# EAGLE design Model 64 Sequencer Cartridge v1 (EAGLE 9.6.2)
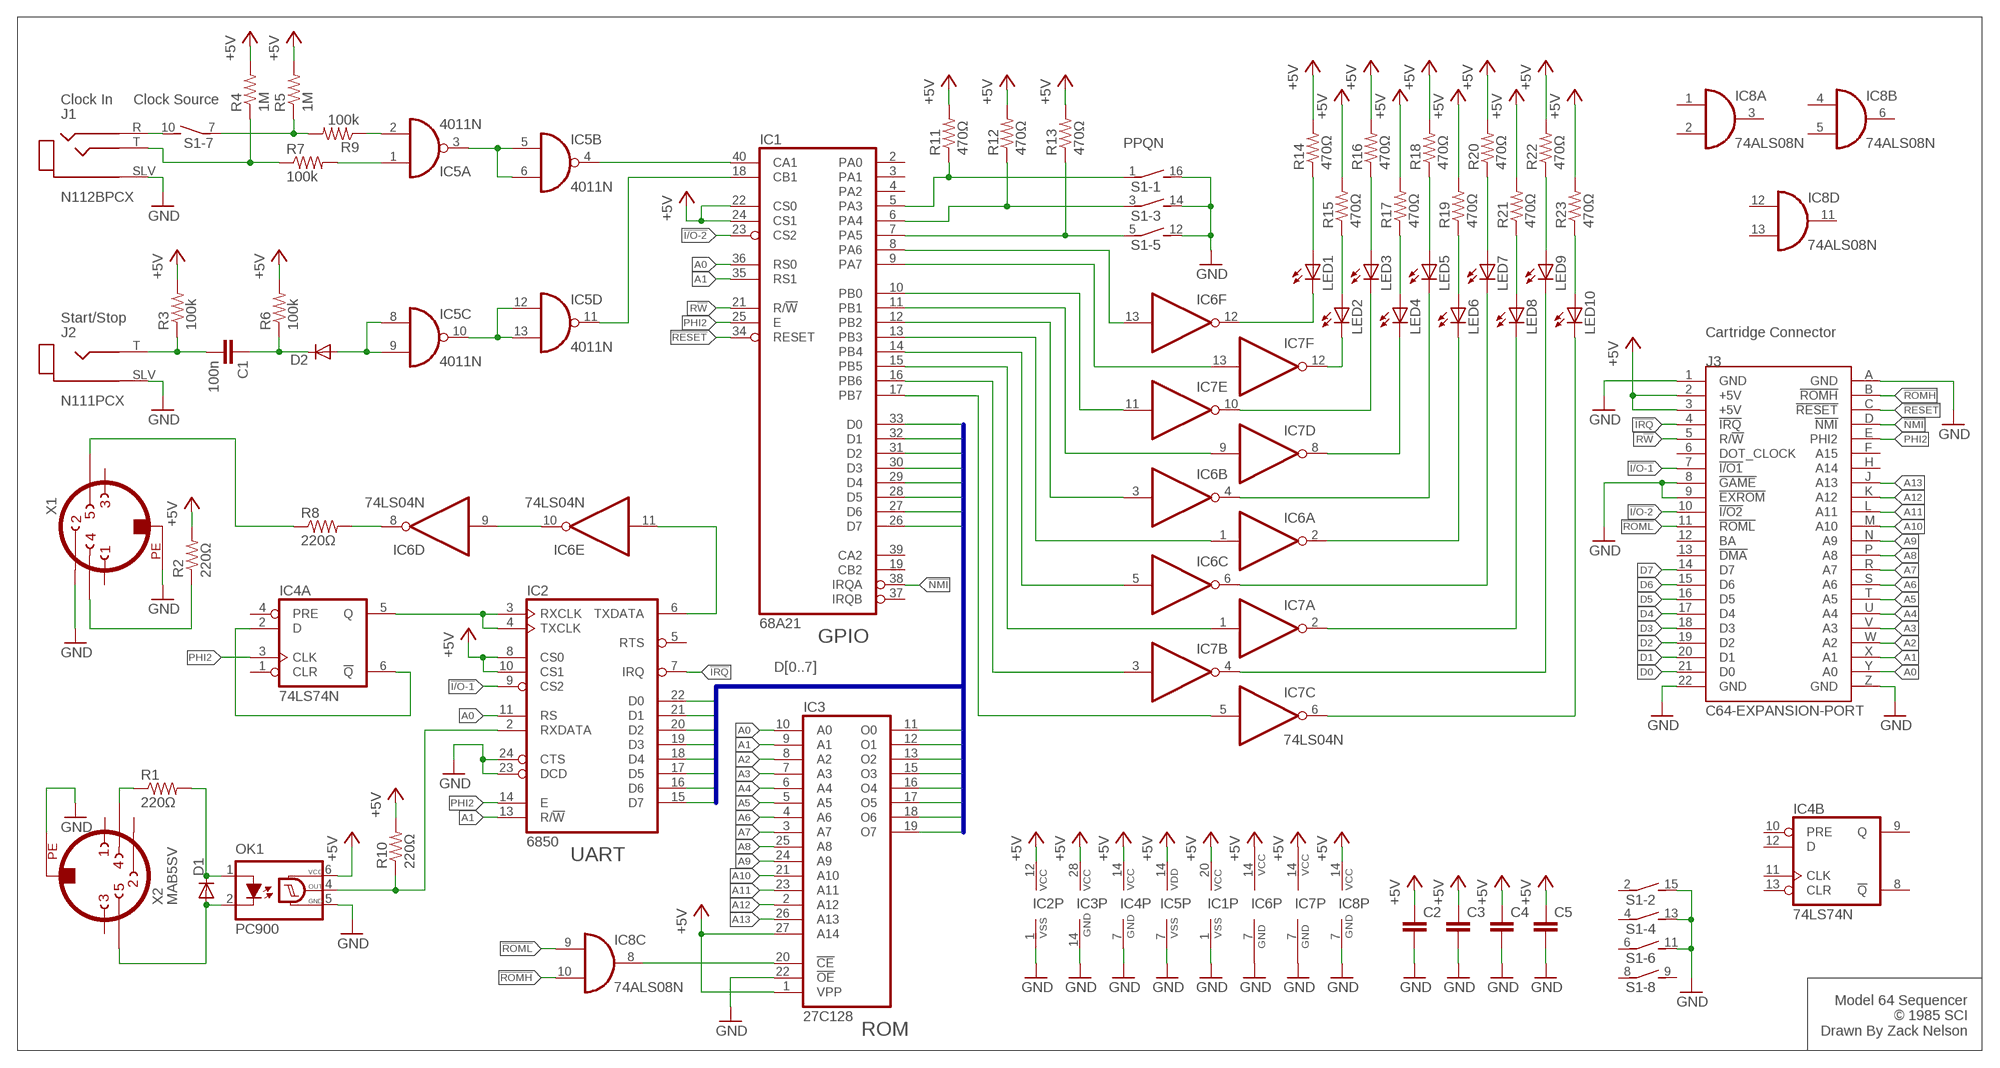
[diagram p0: schematic, sheet 1]

## Parts
C1  100n  C-EU050-024X044  [C050-024X044]
C2  C-EU050-024X044  [C050-024X044]
C3  C-EU050-024X044  [C050-024X044]
C4  C-EU050-024X044  [C050-024X044]
C5  C-EU050-024X044  [C050-024X044]
D1  DIODE-D-7.5  [D-7.5]
D2  DIODE-D-7.5  [D-7.5]
IC1  68A21  6821  [DIL40]
IC2  6850  [DIL24]
IC3  27C128  27256  [DIL28]
IC4  74LS74N  [DIL14]
IC5  4011N  [DIL14]
IC6  74LS04N  [DIL14]
IC7  74LS04N  [DIL14]
IC8  74ALS08N  [DIL14]
J1  N112BPCX  [SWITCHCRAFT_N112BPCX]
J2  N111PCX  [SWITCHCRAFT_N111PCX]
J3  C64-EXPANSION-PORT  C64-EXPANSIONPNARROW  [EXPANSIO_SQ]
LED1  LED3MM  [LED3MM]
LED2  LED3MM  [LED3MM]
LED3  LED3MM  [LED3MM]
LED4  LED3MM  [LED3MM]
LED5  LED3MM  [LED3MM]
LED6  LED3MM  [LED3MM]
LED7  LED3MM  [LED3MM]
LED8  LED3MM  [LED3MM]
LED9  LED3MM  [LED3MM]
LED10  LED3MM  [LED3MM]
OK1  PC900  H11L1M  [DIL06]
R1  220Ω  R-US_0207/12  [0207/12]
R2  220Ω  R-US_0207/12  [0207/12]
R3  100k  R-US_0207/12  [0207/12]
R4  1M  R-US_0207/12  [0207/12]
R5  1M  R-US_0207/12  [0207/12]
R6  100k  R-US_0207/12  [0207/12]
R7  100k  R-US_0207/12  [0207/12]
R8  220Ω  R-US_0207/12  [0207/12]
R9  100k  R-US_0207/12  [0207/12]
R10  220Ω  R-US_0207/12  [0207/12]
R11  470Ω  R-US_0207/12  [0207/12]
R12  470Ω  R-US_0207/12  [0207/12]
R13  470Ω  R-US_0207/12  [0207/12]
R14  470Ω  R-US_0207/12  [0207/12]
R15  470Ω  R-US_0207/12  [0207/12]
R16  470Ω  R-US_0207/12  [0207/12]
R17  470Ω  R-US_0207/12  [0207/12]
R18  470Ω  R-US_0207/12  [0207/12]
R19  470Ω  R-US_0207/12  [0207/12]
R20  470Ω  R-US_0207/12  [0207/12]
R21  470Ω  R-US_0207/12  [0207/12]
R22  470Ω  R-US_0207/12  [0207/12]
R23  470Ω  R-US_0207/12  [0207/12]
S1  DIP08S  [DIP08S]
X1  MAB5SV  [MAB5SV]
X2  MAB5SV  [MAB5SV]

## Nets
!I/O-1: IC2.9(CS2) J3.7(!I/O1)
!I/O-2: IC1.23(CS2) J3.10(!I/O2)
!IRQ: IC2.7(IRQ) J3.4(!IRQ)
!NMI: IC1.38(IRQA) J3.D(!NMI)
!RESET: IC1.34(RESET) J3.C(!RESET)
!ROMH: IC8.10(C:I1) J3.B(!ROMH)
!ROML: IC8.9(C:I0) J3.11(!ROML)
+5V: C2.1 C3.1 C4.1 C5.1 IC1.20(VCC) IC1.22(CS0) IC1.24(CS1) IC2.8(CS0) IC2.10(CS1) IC2.12(VCC) IC3.1(VPP) IC3.27(A14) IC3.28(VCC) IC4.14(P:VCC) IC5.14(P:VDD) IC6.14(P:VCC) IC7.14(P:VCC) IC8.14(P:VCC) J3.2(+5V) J3.3(+5V) OK1.6(VCC) R2.2 R3.2 R4.2 R5.2 R6.2 R10.2 R11.2 R12.2 R13.2 R14.2 R15.2 R16.2 R17.2 R18.2 R19.2 R20.2 R21.2 R22.2 R23.2
A0: IC1.36(RS0) IC2.11(RS) IC3.10(A0) J3.Y(A0)
A1: IC1.35(RS1) IC2.13(R/!W) IC3.9(A1) J3.X(A1)
A2: IC3.8(A2) J3.W(A2)
A3: IC3.7(A3) J3.V(A3)
A4: IC3.6(A4) J3.U(A4)
A5: IC3.5(A5) J3.T(A5)
A6: IC3.4(A6) J3.S(A6)
A7: IC3.3(A7) J3.R(A7)
A8: IC3.25(A8) J3.P(A8)
A9: IC3.24(A9) J3.N(A9)
A10: IC3.21(A10) J3.M(A10)
A11: IC3.23(A11) J3.L(A11)
A12: IC3.2(A12) J3.K(A12)
A13: IC3.26(A13) J3.J(A13)
D0: IC1.33(D0) IC2.22(D0) IC3.11(O0) J3.21(D0)
D1: IC1.32(D1) IC2.21(D1) IC3.12(O1) J3.20(D1)
D2: IC1.31(D2) IC2.20(D2) IC3.13(O2) J3.19(D2)
D3: IC1.30(D3) IC2.19(D3) IC3.15(O3) J3.18(D3)
D4: IC1.29(D4) IC2.18(D4) IC3.16(O4) J3.17(D4)
D5: IC1.28(D5) IC2.17(D5) IC3.17(O5) J3.16(D5)
D6: IC1.27(D6) IC2.16(D6) IC3.18(O6) J3.15(D6)
D7: IC1.26(D7) IC2.15(D7) IC3.19(O7) J3.14(D7)
GND: C2.2 C3.2 C4.2 C5.2 IC1.1(VSS) IC2.1(VSS) IC2.23(DCD) IC2.24(CTS) IC3.14(GND) IC3.22(!OE) IC4.7(P:GND) IC5.7(P:VSS) IC6.7(P:GND) IC7.7(P:GND) IC8.7(P:GND) J1.SLV(SLEEVE) J2.SLV(SLEEVE) J3.1(GND) J3.8(!GAME) J3.9(!EXROM) J3.22(GND) J3.A(GND) J3.Z(GND) OK1.5(GND) S1.11 S1.12 S1.13 S1.14 S1.15 S1.16 X1.2 X1.PE X2.PE
N$1: IC2.3(RXCLK) IC2.4(TXCLK) IC4.5(A:Q)
N$2: R2.1 X1.4
N$3: IC2.6(TXDATA) IC6.11(E:I)
N$4: IC4.2(A:D) IC4.6(A:!Q)
N$5: IC6.9(D:I) IC6.10(E:O)
N$6: IC6.8(D:O) R8.2
N$7: IC1.13(PB3) IC6.1(A:I)
N$8: IC5.3(A:O) IC5.5(B:I0) IC5.6(B:I1)
N$9: D2.A IC5.8(C:I0) IC5.9(C:I1)
N$10: IC5.10(C:O) IC5.12(D:I0) IC5.13(D:I1)
N$11: IC1.18(CB1) IC5.11(D:O)
N$12: IC1.40(CA1) IC5.4(B:O)
N$13: IC5.1(A:I0) R7.2
N$14: LED6.A R19.1
N$15: LED5.A R18.1
N$16: LED7.A R20.1
N$17: LED1.A R14.1
N$18: LED2.A R15.1
N$19: LED8.A R21.1
N$20: LED9.A R22.1
N$21: IC7.2(A:O) LED8.K(C)
N$22: IC7.4(B:O) LED9.K(C)
N$23: IC7.6(C:O) LED10.K(C)
N$24: IC7.8(D:O) LED4.K(C)
N$25: IC7.10(E:O) LED3.K(C)
N$26: IC7.12(F:O) LED2.K(C)
N$27: LED10.A R23.1
N$28: LED4.A R17.1
N$29: LED3.A R16.1
N$30: IC1.5(PA3) R11.1 S1.1
N$31: IC1.6(PA4) R12.1 S1.3
N$32: IC1.7(PA5) R13.1 S1.5
N$33: J1.T(TIP) R4.1 R7.1
N$34: C1.1 D2.C R6.1
N$35: C1.2 J2.T(TIP) R3.1
N$36: IC5.2(A:I1) R9.1
N$37: R5.1 R9.2 S1.7
N$38: J1.R(RING) S1.10
N$39: D1.A OK1.2(C) X2.5
N$40: D1.C OK1.1(A) R1.2
N$41: IC2.2(RXDATA) OK1.4(OUT) R10.1
N$42: IC6.12(F:O) LED1.K(C)
N$43: IC1.15(PB5) IC7.1(A:I)
N$44: IC1.9(PA7) IC7.13(F:I)
N$45: IC1.16(PB6) IC7.3(B:I)
N$46: IC1.17(PB7) IC7.5(C:I)
N$47: IC1.11(PB1) IC7.9(D:I)
N$48: IC1.10(PB0) IC7.11(E:I)
N$49: IC1.8(PA6) IC6.13(F:I)
N$50: IC6.6(C:O) LED7.K(C)
N$51: IC1.14(PB4) IC6.5(C:I)
N$52: IC1.12(PB2) IC6.3(B:I)
N$53: IC6.4(B:O) LED5.K(C)
N$54: IC6.2(A:O) LED6.K(C)
N$55: R8.1 X1.5
N$56: R1.1 X2.4
N$57: IC3.20(!CE) IC8.8(C:O)
PHI2: IC1.25(E) IC2.14(E) IC4.3(A:CLK) J3.E(PHI2)
R!W: IC1.21(R/!W) J3.5(R/!W)
Unconnected: IC1.2(PA0) IC1.3(PA1) IC1.4(PA2) IC1.19(CB2) IC1.37(IRQB) IC1.39(CA2) IC2.5(RTS) IC4.1(A:CLR) IC4.4(A:PRE) IC4.8(B:!Q) IC4.9(B:Q) IC4.10(B:PRE) IC4.11(B:CLK) IC4.12(B:D) IC4.13(B:CLR) IC8.1(A:I0) IC8.2(A:I1) IC8.3(A:O) IC8.4(B:I0) IC8.5(B:I1) IC8.6(B:O) IC8.11(D:O) IC8.12(D:I0) IC8.13(D:I1) J3.6(DOT_CLOCK) J3.12(BA) J3.13(!DMA) J3.F(A15) J3.H(A14) S1.2 S1.4 S1.6 S1.8 S1.9 X1.1 X1.3 X2.1 X2.2 X2.3

## Buses
D[0..7]

## Notes on the sheet
- Clock In | Clock Source
- PPQN
- Start/Stop
- Cartridge Connector
- GPIO
- UART
- ROM
- Model 64 Sequencer
  © 1985 SCI
  Drawn By Zack Nelson

## Library data of the parts
C1-C5 = rcl:C-EU: CAPACITOR, European symbol; SPICEPREFIX: C
D1 D2 = diode:DIODE-: DIODE
IC1 = micro-motorola:6821: MICROCONTROLLER/MEMORY DEVICE; MF: NTE ELECTRONICS; MPN: NTE6821; OC_FARNELL: 1652403; OC_NEWARK: 29C4772
IC2 = micro-motorola:6850: MICROCONTROLLER/MEMORY DEVICE; MF: NTE ELECTRONICS; MPN: NTE6850; OC_FARNELL: 4899775; OC_NEWARK: 31C2457
IC3 = memory:27256: MEMORY
IC4 = 74xx-eu:74*74: Dual D type positive edge triggered FLIP FLOP, preset and clear
IC5 = 40xx:4011: Quad 2-input NAND
IC6 IC7 = 74xx-us:74*04: Hex INVERTER
IC8 = 74xx-eu:74*08: Quad 2-input AND gate
J1 = N112BPCX:N112BPCX; MANUFACTURER: Switchcarft; MAXIMUM_PACKAGE_HIEGHT: 28.12mm; PARTREV: A; STANDARD: IPC 7351B
J2 = N111PCX:N111PCX; MANUFACTURER: Switchcarft; MAXIMUM_PACKAGE_HIEGHT: 28.12mm; PARTREV: A; STANDARD: IPC 7351B
J3 = Commodore:C64-EXPANSIONP
LED1-LED10 = led:LED: LED OSRAM: - CHIPLED LG R971, LG N971, LY N971, LG Q971, LY Q971, LO R971, LY R971 LH N974, LH R974 LS Q976, LO Q976, LY Q976 LO Q996 - Hyper CHIPLED LW Q18S LB Q993, LB Q99A, LB R99A - SideLED LS A670, LO A670, LY A670, LG A670, LP A670 LB A673, LV A673, LT A673, LW A673 LH A674 LY A675 LS A676, LA A676, LO A676, LY A676, LW A676 LS A679, LY A679, LG A679 - Hyper Micro SIDELED® LS Y876, LA Y876, LO Y876, LY Y876 LT Y87S - SmartLED LW L88C, LW L88S LB L89C, LB L89S, LG L890 LS L89K, LO L89K, LY L89K LS L896, LA L896, LO L896, LY L896 - TOPLED LS T670, LO T670, LY T670, LG T670, LP T670 LSG T670, LSP T670, LSY T670, LOP T670, LYG T670 LG T671, LOG T671, LSG T671 LB T673, LV T673, LT T673, LW T673 LH T674 LS T676, LA T676, LO T676, LY T676, LB T676, LH T676, LSB T676, LW T676 LB T67C, LV T67C, LT T67C, LS T67K, LO T67K, LY T67K, LW E67C LS E67B, LA E67B, LO E67B, LY E67B, LB E67C, LV E67C, LT E67C LW T67C LS T679, LY T679, LG T679 LS T770, LO T770, LY T770, LG T770, LP T770 LB T773, LV T773, LT T773, LW T773 LH T774 LS E675, LA E675, LY E675, LS T675 LS T776, LA T776, LO T776, LY T776, LB T776 LHGB T686 LT T68C, LB T68C - Hyper Mini TOPLED® LB M676 - Mini TOPLED Santana® LG M470 LS M47K, LO M47K, LY M47K Source: http://www.osram.convergy.de LUXEON: - LUMILED® LXK2-PW12-R00, LXK2-PW12-S00, LXK2-PW14-U00, LXK2-PW14-V00 LXK2-PM12-R00, LXK2-PM12-S00, LXK2-PM14-U00 LXK2-PE12-Q00, LXK2-PE12-R00, LXK2-PE12-S00, LXK2-PE14-T00, LXK2-PE14-U00 LXK2-PB12-K00, LXK2-PB12-L00, LXK2-PB12-M00, LXK2-PB14-N00, LXK2-PB14-P00, LXK2-PB14-Q00 LXK2-PR12-L00, LXK2-PR12-M00, LXK2-PR14-Q00, LXK2-PR14-R00 LXK2-PD12-Q00, LXK2-PD12-R00, LXK2-PD12-S00 LXK2-PH12-R00, LXK2-PH12-S00 LXK2-PL12-P00, LXK2-PL12-Q00, LXK2-PL12-R00 Source: www.luxeon.com KINGBRIGHT: KA-3528ASYC Source: www.kingbright.com
OK1 = optocoupler:H11L*M: 6-Pin DIP Optocoupler Source: http://www.fairchildsemi.com/ds/H1/H11L2-M.pdf; MF: FAIRCHILD SEMICONDUCTOR; MPN: H11L1-M; OC_FARNELL: 1021127; OC_NEWARK: 72K8643
R1-R23 = rcl:R-US_: RESISTOR, American symbol; SPICEPREFIX: R
S1 = switch-dil:DIP08S: DIL/CODE SWITCH; OC_FARNELL: unknown; OC_NEWARK: unknown
X1 X2 = con-hirschmann:MAB5SV: Female CONNECTOR 5 pins 90 deg. with shield, vertical (DIN41524); OC_FARNELL: unknown; OC_NEWARK: unknown

## Board
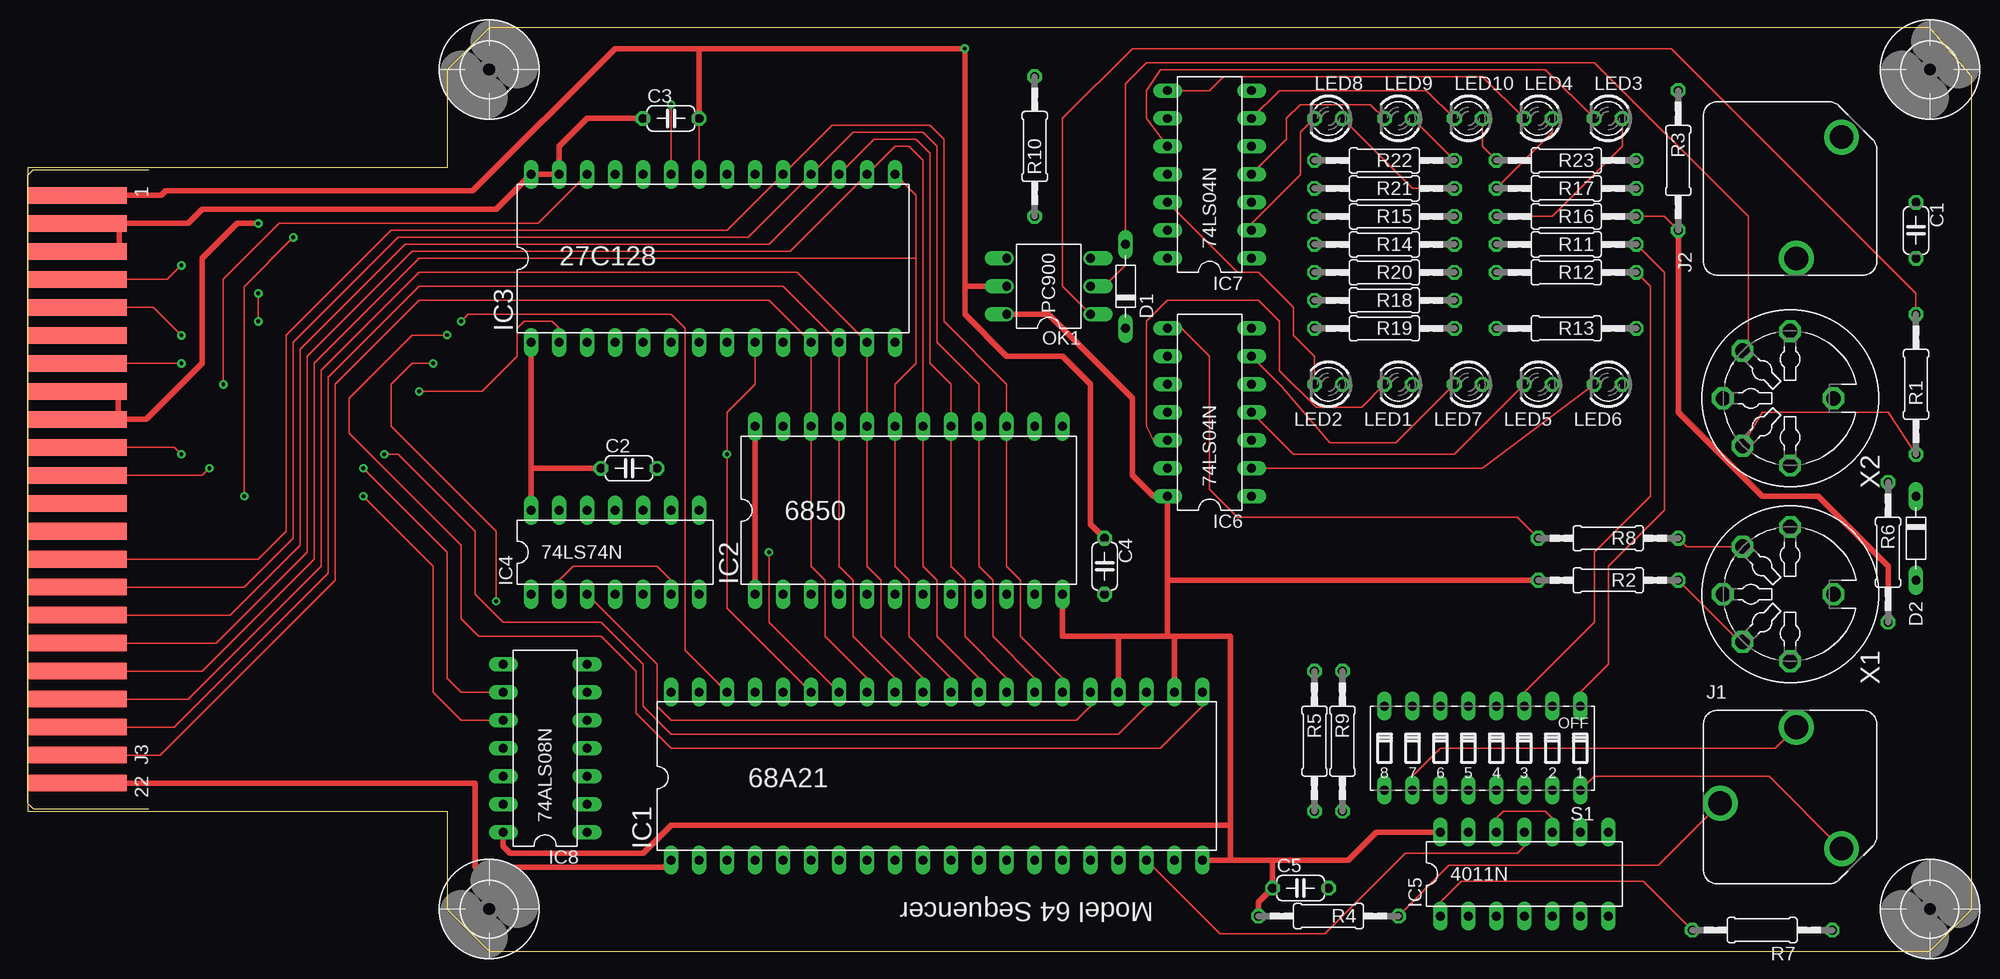
[diagram p1: board, top side]
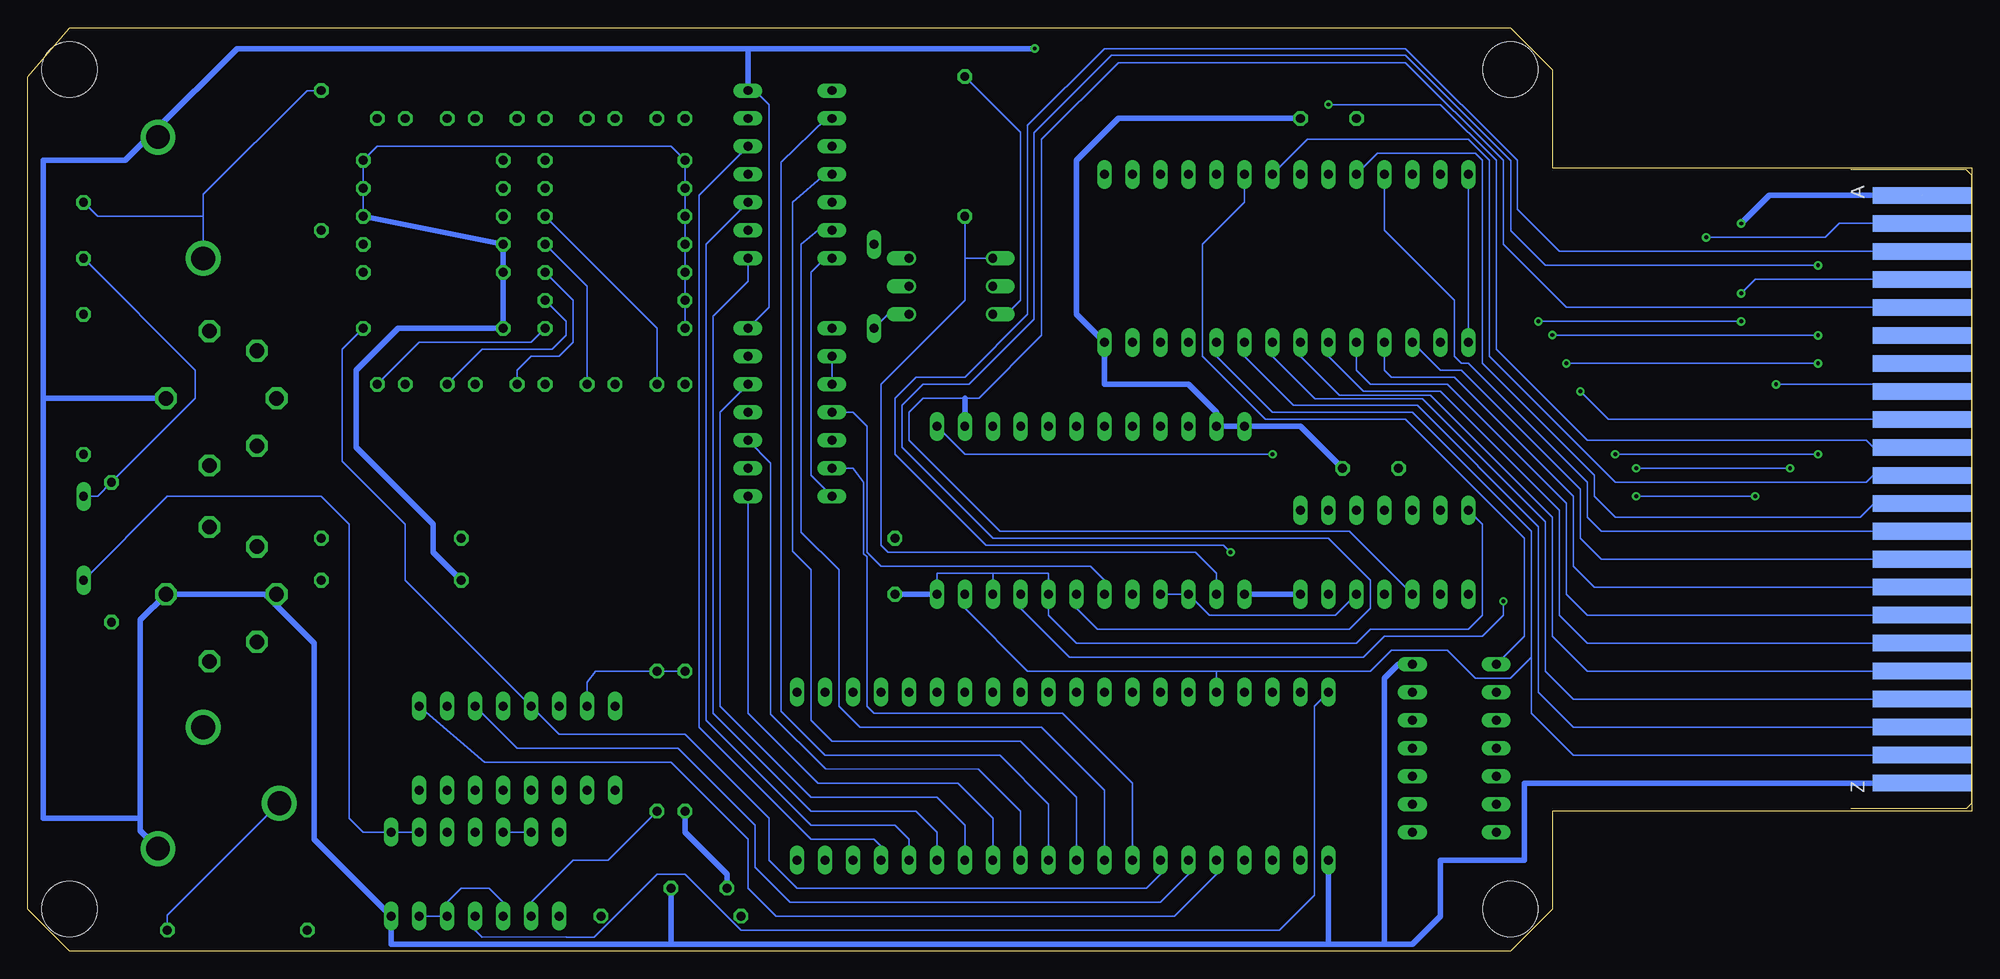
[diagram p2: board, bottom side, seen from below]

Size 176.53 x 83.82 mm. Coordinates in mm from the lower left corner, seen from the top.
Outline: 0,12.7 38.1,12.7 38.1,3.81 41.91,0 172.72,0 176.53,3.81 176.53,79.38 172.72,83.82 171.12,83.81 41.91,83.82 38.1,80.01 38.1,71.11 0,71.11 0,12.7
Copper layers (1*16): Top 0.035mm / dielectric 1.5mm / Bottom 0.035mm
Design rules "default": minimum track width 6mil, minimum drill 0.35mm, track to track 6mil, track to pad 6mil, pad to pad 6mil, via to via 6mil, smd to smd 6mil, copper to edge 40mil, drill to drill 6mil, minimum pad ring 10mil, minimum via ring 8mil, stop-mask expansion 4mil, vias tented up to drill 0mil, thermal gap 10mil

### Footprints (pad centres in the part's own frame; a part is rotated, then mirrored left to right if it is on the bottom)
C050-024X044 = drill 0.813 octagon: 1 -2.54,0; 2 2.54,0
D-7.5 = drill 0.813 long: A 3.81,0; C -3.81,0
DIL40 = drill 0.813 long: 1 -24.13,-7.62; 2 -21.59,-7.62; 3 -19.05,-7.62; 4 -16.51,-7.62; 5 -13.97,-7.62; 6 -11.43,-7.62; 7 -8.89,-7.62; 8 -6.35,-7.62; 9 -3.81,-7.62; 10 -1.27,-7.62; 11 1.27,-7.62; 12 3.81,-7.62; 13 6.35,-7.62; 14 8.89,-7.62; 15 11.43,-7.62; 16 13.97,-7.62; 17 16.51,-7.62; 18 19.05,-7.62; 19 21.59,-7.62; 20 24.13,-7.62; 21 24.13,7.62; 22 21.59,7.62; 23 19.05,7.62; 24 16.51,7.62; 25 13.97,7.62; 26 11.43,7.62; 27 8.89,7.62; 28 6.35,7.62; 29 3.81,7.62; 30 1.27,7.62; 31 -1.27,7.62; 32 -3.81,7.62; 33 -6.35,7.62; 34 -8.89,7.62; 35 -11.43,7.62; 36 -13.97,7.62; 37 -16.51,7.62; 38 -19.05,7.62; 39 -21.59,7.62; 40 -24.13,7.62
DIL24 = drill 0.813 long: 1 -13.97,-7.62; 2 -11.43,-7.62; 3 -8.89,-7.62; 4 -6.35,-7.62; 5 -3.81,-7.62; 6 -1.27,-7.62; 7 1.27,-7.62; 8 3.81,-7.62; 9 6.35,-7.62; 10 8.89,-7.62; 11 11.43,-7.62; 12 13.97,-7.62; 13 13.97,7.62; 14 11.43,7.62; 15 8.89,7.62; 16 6.35,7.62; 17 3.81,7.62; 18 1.27,7.62; 19 -1.27,7.62; 20 -3.81,7.62; 21 -6.35,7.62; 22 -8.89,7.62; 23 -11.43,7.62; 24 -13.97,7.62
DIL28 = drill 0.813 long: 1 -16.51,-7.62; 2 -13.97,-7.62; 3 -11.43,-7.62; 4 -8.89,-7.62; 5 -6.35,-7.62; 6 -3.81,-7.62; 7 -1.27,-7.62; 8 1.27,-7.62; 9 3.81,-7.62; 10 6.35,-7.62; 11 8.89,-7.62; 12 11.43,-7.62; 13 13.97,-7.62; 14 16.51,-7.62; 15 16.51,7.62; 16 13.97,7.62; 17 11.43,7.62; 18 8.89,7.62; 19 6.35,7.62; 20 3.81,7.62; 21 1.27,7.62; 22 -1.27,7.62; 23 -3.81,7.62; 24 -6.35,7.62; 25 -8.89,7.62; 26 -11.43,7.62; 27 -13.97,7.62; 28 -16.51,7.62
DIL14 = drill 0.813 long: 1 -7.62,-3.81; 2 -5.08,-3.81; 3 -2.54,-3.81; 4 0,-3.81; 5 2.54,-3.81; 6 5.08,-3.81; 7 7.62,-3.81; 8 7.62,3.81; 9 5.08,3.81; 10 2.54,3.81; 11 0,3.81; 12 -2.54,3.81; 13 -5.08,3.81; 14 -7.62,3.81
SWITCHCRAFT_N112BPCX = drill 2.159: R 0.559,6.35; SLV 4.669,-4.669; T -6.35,-0.559
SWITCHCRAFT_N111PCX = drill 2.159: SLV 4.669,-4.669; T -6.35,-0.559
EXPANSIO_SQ = smd 1.5 x 9: 1 26.67,-4.5; 2 24.13,-4.5; 3 21.59,-4.5; 4 19.05,-4.5; 5 16.51,-4.5; 6 13.97,-4.5; 7 11.43,-4.5; 8 8.89,-4.5; 9 6.35,-4.5; 10 3.81,-4.5; 11 1.27,-4.5; 12 -1.27,-4.5; 13 -3.81,-4.5; 14 -6.35,-4.5; 15 -8.89,-4.5; 16 -11.43,-4.5; 17 -13.97,-4.5; 18 -16.51,-4.5; 19 -19.05,-4.5; 20 -21.59,-4.5; 21 -24.13,-4.5; 22 -26.67,-4.5 | smd 1.5 x 9 bottom: A 26.67,-4.5; B 24.13,-4.5; C 21.59,-4.5; D 19.05,-4.5; E 16.51,-4.5; F 13.97,-4.5; H 11.43,-4.5; J 8.89,-4.5; K 6.35,-4.5; L 3.81,-4.5; M 1.27,-4.5; N -1.27,-4.5; P -3.81,-4.5; R -6.35,-4.5; S -8.89,-4.5; T -11.43,-4.5; U -13.97,-4.5; V -16.51,-4.5; W -19.05,-4.5; X -21.59,-4.5; Y -24.13,-4.5; Z -26.67,-4.5
LED3MM = drill 0.813 octagon: A -1.27,0; K 1.27,0
DIL06 = drill 0.813 offset: 1 -2.54,-3.81; 2 0,-3.81; 3 2.54,-3.81; 4 2.54,3.81; 5 0,3.81; 6 -2.54,3.81
0207/12 = drill 0.813 octagon: 1 -6.35,0; 2 6.35,0
DIP08S = drill 0.813 long: 1 -8.89,-3.81; 2 -6.35,-3.81; 3 -3.81,-3.81; 4 -1.27,-3.81; 5 1.27,-3.81; 6 3.81,-3.81; 7 6.35,-3.81; 8 8.89,-3.81; 9 8.89,3.81; 10 6.35,3.81; 11 3.81,3.81; 12 1.27,3.81; 13 -1.27,3.81; 14 -3.81,3.81; 15 -6.35,3.81; 16 -8.89,3.81
5,0 = hole 5: 0,0
MAB5SV = drill 1.321 octagon: 1 6.096,0; 2 0,-6.096; 3 -6.096,0; 4 4.318,-4.318; 5 -4.318,-4.318; PE 0,3.937

### Placement (x,y rotation side)
C1  171.45,65.41 90 top
C2  54.61,43.81 0 top
C3  58.42,75.56 0 top
C4  97.79,34.92 90 top
C5  115.57,5.71 0 top
D1  99.69,60.32 90 top
D2  171.45,37.46 270 top
IC1  82.55,15.88 0 top
IC2  80.01,40 0 top
IC3  62.23,62.86 0 top
IC4  53.34,36.2 0 top
IC5  135.89,6.99 0 top
IC6  107.31,48.89 90 top
IC7  107.31,70.48 90 top
IC8  46.99,18.41 90 top
J1  160.02,13.97 0 top
J2  160.02,69.22 90 top
J3  0,41.91 90 top
LED1  124.46,51.44 180 top
LED2  118.11,51.44 180 top
LED3  143.51,75.56 180 top
LED4  137.16,75.56 180 top
LED5  137.16,51.44 180 top
LED6  143.51,51.44 180 top
LED7  130.81,51.44 180 top
LED8  118.11,75.56 180 top
LED9  124.46,75.56 180 top
LED10  130.81,75.56 180 top
OK1  92.71,60.32 90 top
R1  171.45,51.44 90 top
R2  143.51,33.66 180 top
R3  149.86,71.75 270 top
R4  118.11,3.17 180 top
R5  116.84,19.05 270 top
R6  168.91,36.2 270 top
R7  157.48,1.91 180 top
R8  143.51,37.46 180 top
R9  119.38,19.05 90 top
R10  91.44,73.03 90 top
R11  139.7,64.14 180 top
R12  139.7,61.59 180 top
R13  139.7,56.52 180 top
R14  123.19,64.14 180 top
R15  123.19,66.67 180 top
R16  139.7,66.67 0 top
R17  139.7,69.22 0 top
R18  123.19,59.05 180 top
R19  123.19,56.52 180 top
R20  123.19,61.59 180 top
R21  123.19,69.22 180 top
R22  123.19,71.75 180 top
R23  139.7,71.75 0 top
S1  132.08,18.41 180 top
U$1  [5,0]  41.91,3.81 0 top
U$2  [5,0]  41.91,80.01 0 top
U$3  [5,0]  172.72,80.01 0 top
U$4  [5,0]  172.72,3.81 0 top
X1  160.02,32.38 270 top
X2  160.02,50.16 270 top

### Tracks (layer width: path | path; a pad name or v marks a point on that pad's centre or on a via)
!I/O-1  (via drill 0.35)
  Top 0.152: v42.55,31.75 42.55,38.1 33.02,47.62 33.02,51.44 34.92,53.34 v36.83,53.34 | v13.97,53.34 J3.7
  Bottom 0.152: IC2.9 86.36,31.12 81.92,26.67 55.24,26.67 53.34,28.57 44.45,28.57 42.55,30.48 v42.55,31.75 | v36.83,53.34 v13.97,53.34
!I/O-2  (via drill 0.35)
  Top 0.152: IC1.23 101.6,22.22 99.06,19.68 58.42,19.68 55.88,22.22 55.88,26.04 52.07,29.84 43.18,29.84 40.64,32.38 40.64,38.1 33.66,45.09 v32.38,45.09 | J3.10 13.34,45.72 v13.97,45.09
  Bottom 0.152: v13.97,45.09 v32.38,45.09
!IRQ  (via drill 0.35)
  Top 0.152: v13.97,62.23 12.7,60.96 J3.4
  Bottom 0.152: IC2.7 81.28,31.12 79.38,29.21 56.52,29.21 54.61,31.12 54.61,33.66 58.42,37.46 88.9,37.46 97.16,45.72 97.16,49.53 95.25,51.44 91.05,51.44 85.15,57.33 85.15,74.27 78.13,81.29 51.44,81.29 41.86,71.71 41.86,65.36 38.73,62.23 v13.97,62.23
!NMI  (via drill 0.35)
  Top 0.152: v20.95,59.69 v20.95,57.15 | v39.37,57.15 40.01,57.78 58.42,57.78 59.69,56.52 59.69,27.3 IC1.38
  Bottom 0.152: J3.D 19.68,60.96 v20.95,59.69 | v20.95,57.15 v39.37,57.15
!RESET  (via drill 0.35)
  Top 0.152: v67.31,36.2 67.31,29.84 IC1.34
  Bottom 0.152: J3.C 37.47,63.5 41.27,67.31 41.27,71.75 51.44,81.91 78.74,81.91 85.72,74.93 85.72,57.78 91.44,52.07 95.89,52.07 97.79,50.16 97.79,45.09 89.53,36.83 67.94,36.83 v67.31,36.2
!ROMH  (via drill 0.35)
  Top 0.152: v19.68,41.27 19.66,41.3 19.66,60.3 v24.13,64.77 | IC8.10 39.37,20.95 36.83,23.49 36.83,34.92 v30.48,41.27
  Bottom 0.152: J3.B 12.06,66.04 13.34,64.77 v24.13,64.77 | v19.68,41.27 v30.48,41.27
!ROML  (via drill 0.35)
  Top 0.152: IC8.9 39.37,23.49 38.1,24.77 38.1,36.2 v30.48,43.81 | v16.51,43.81 15.88,43.18 J3.11
  Bottom 0.152: v30.48,43.81 v16.51,43.81
+5V
  Top 0.152: R16.2 148.59,66.67 R3.2
  Top 0.508: OK1.6 92.71,57.78 100.33,50.16 100.33,43.18 102.23,41.27 IC6.14 103.5,33.66 | IC2.12 93.98,28.57 99.06,28.57 | 99.06,28.57 103.5,28.57 | 103.5,28.57 104.14,28.57 | 104.14,28.57 109.22,28.57 109.22,11.43 | 109.22,11.43 109.22,8.26 | IC1.22 104.14,28.57 | IC1.24 99.06,28.57 | IC3.1 45.72,43.81 | 45.72,43.81 IC4.14 | C2.1 45.72,43.81 | IC1.20 109.22,8.26 | 113.03,8.26 109.22,8.26 | 103.5,33.66 103.5,28.57 | R2.2 103.5,33.66 | R3.2 149.86,48.89 157.48,41.27 162.56,41.27 168.91,34.92 R6.2 | J3.3 8.31,63.5 8.31,66.04 J3.2 14.61,66.04 15.88,67.31 42.55,67.31 IC3.28 IC3.27 48.26,73.03 50.8,75.56 C3.1 | IC8.14 43.18,9.53 43.81,8.89 55.88,8.89 58.42,11.43 109.22,11.43 | R4.2 111.76,4.44 C5.1 113.03,8.26 | 113.03,8.26 119.92,8.26 122.46,10.79 IC5.14
  Bottom 0.152: IC2.12 93.98,34.29 88.9,34.29 | 88.9,34.29 83.82,34.29 IC2.8 83.82,30.48 81.28,27.94 55.88,27.94 54.61,29.21 45.72,29.21 44.45,30.48 44.45,38.73 IC4.14 | IC2.10 88.9,34.29 | R19.2 R18.2 R20.2 R14.2 R15.2 R21.2 R22.2 118.11,73.03 144.78,73.03 R23.2 R17.2 R16.2 | IC7.14 104.14,62.86 105.41,61.59 105.41,43.18 IC6.14 | R10.2 86.36,74.3 86.36,59.05 87.63,57.78 OK1.6 | IC3.28 IC3.1
  Bottom 0.508: R16.2 R11.2 R12.2 R13.2 142.88,56.52 146.69,52.7 146.69,45.72 139.7,38.73 139.7,36.2 R2.2 | C5.1 113.03,6.99 116.84,10.79 R5.2 | C4.1 IC2.12
A0
  Bottom 0.152: 68.58,25.4 54.61,25.4 52.7,27.3 47.62,27.3 45.09,24.77 41.91,24.77 40.01,26.67 | 68.58,25.4 85.72,25.4 91.44,31.12 IC2.11 | IC1.36 68.58,25.4 | J3.Y 36.2,17.78 40.01,21.59 40.01,26.67 | 40.01,26.67 40.01,38.1 50.8,48.89 63.5,48.89 68.58,53.98 IC3.10
A1  (via drill 0.35)
  Top 0.152: IC3.9 66.04,51.44 63.5,48.89 v63.5,45.09 63.5,31.12 IC1.35
  Bottom 0.152: J3.X 36.2,20.32 39.37,23.49 39.37,38.53 50.37,49.53 61.59,49.53 66.04,53.98 IC3.9 | IC2.13 91.44,45.09 v63.5,45.09
A2
  Bottom 0.152: J3.W 36.2,22.86 38.73,25.4 38.73,38.96 49.91,50.14 59.66,50.14 63.5,53.98 IC3.8
A3
  Bottom 0.152: J3.V 34.92,25.4 38.1,28.57 38.1,39.39 49.15,50.44 57.43,50.44 60.96,53.98 IC3.7
A4
  Bottom 0.152: J3.U 34.92,27.94 37.47,30.48 37.47,40 48.26,50.8 55.24,50.8 58.42,53.98 IC3.6
A5
  Bottom 0.152: J3.T 34.92,30.48 36.83,32.38 36.83,40.64 47.62,51.44 54.61,51.44 55.88,52.7 IC3.5
A6
  Bottom 0.152: J3.S 34.29,33.02 36.2,34.92 36.2,41.27 46.99,52.07 52.7,52.07 53.34,52.7 IC3.4
A7
  Bottom 0.152: J3.R 33.66,35.56 35.56,37.46 35.56,41.91 46.35,52.7 48.26,52.7 IC3.3
A8
  Bottom 0.152: IC3.25 53.34,65.41 46.99,59.05 46.99,53.98 46.35,53.34 45.72,53.34 34.92,42.55 34.92,39.37 33.66,38.1 J3.P
A9
  Bottom 0.152: IC3.24 53.98,72.39 45.09,72.39 44.45,71.75 44.45,53.34 34.29,43.18 34.29,41.27 32.38,39.37 10.16,39.37 8.89,40.64 J3.N
A10
  Bottom 0.152: IC3.21 60.33,73.66 45.72,73.66 43.81,71.75 43.81,53.98 32.38,42.55 9.58,42.55 8.95,43.18 J3.M
A11  (via drill 0.35)
  Top 0.152: IC3.23 v58.42,76.83
  Bottom 0.152: v58.42,76.83 48.26,76.83 43.18,71.75 43.18,54.61 34.92,46.35 9.58,46.35 8.95,45.72 J3.L
A12  (via drill 0.35)
  Top 0.152: IC3.2 48.26,56.52 47.62,57.15 45.09,57.15 44.45,56.52 44.45,53.98 41.27,50.8 v35.56,50.8
  Bottom 0.152: J3.K 33.02,48.26 v35.56,50.8
A13  (via drill 0.35)
  Top 0.152: IC3.26 46.35,66.04 22.86,66.04 17.78,60.96 v17.78,51.44
  Bottom 0.152: J3.J 5.13,51.44 v17.78,51.44
D0
  Top 0.152: IC1.33 76.2,24.77 72.39,28.57 72.39,33.66 71.12,34.92 IC2.22 IC3.11 67.31,59.05 35.56,59.05 27.94,51.44 27.94,33.66 12.06,17.78 J3.21
D1
  Top 0.152: IC1.32 78.74,24.77 74.93,28.57 74.93,33.66 73.66,34.92 IC2.21 IC3.12 68.58,60.32 35.56,60.32 27.3,52.07 27.3,34.29 13.34,20.32 J3.20
D2
  Top 0.152: IC1.31 81.28,24.77 77.47,28.57 77.47,33.66 76.2,34.92 IC2.20 IC3.13 69.85,61.59 35.56,61.59 26.67,52.7 26.67,34.92 14.61,22.86 J3.19
D3
  Top 0.152: IC1.30 83.82,24.77 80.01,28.57 80.01,33.66 78.74,34.92 IC2.19 78.74,51.44 80.64,53.34 80.64,62.86 | IC3.15 80.64,68.58 80.64,62.86 | J3.18 15.88,25.4 26.04,35.56 26.04,53.34 35.56,62.86 80.64,62.86
D4
  Top 0.152: IC1.29 86.36,24.77 82.55,28.57 82.55,33.66 81.28,34.92 IC2.18 81.28,71.75 80.01,73.03 78.74,73.03 IC3.16 69.22,63.5 34.92,63.5 25.4,53.98 25.4,36.2 17.14,27.94 J3.17
D5
  Top 0.152: IC1.28 88.9,24.77 85.09,28.57 85.09,33.66 83.82,34.92 IC2.17 83.82,51.44 81.92,53.34 81.92,72.39 80.64,73.66 76.83,73.66 IC3.17 67.31,64.14 34.29,64.14 24.77,54.61 24.77,36.83 18.41,30.48 J3.16
D6
  Top 0.152: IC1.27 91.44,24.77 87.63,28.57 87.63,33.66 86.36,34.92 IC2.16 86.36,51.44 82.55,55.24 82.55,73.03 81.28,74.3 74.93,74.3 IC3.18 65.41,64.77 33.66,64.77 24.13,55.24 24.13,37.46 19.68,33.02 J3.15
D7
  Top 0.152: IC1.26 93.98,24.77 90.17,28.57 90.17,33.66 88.9,34.92 IC2.15 88.9,51.44 83.19,57.15 83.19,73.68 81.92,74.93 73.03,74.93 IC3.19 63.5,65.41 33.02,65.41 23.5,55.88 23.5,38.1 20.95,35.56 J3.14
GND  (via drill 0.35)  (1 unrouted)
  Top 0.152: S1.11 S1.12 S1.13 S1.14 S1.15 S1.16 142.24,15.88 158.12,15.88 J1.SLV | IC3.22 C3.2
  Top 0.508: 60.96,81.91 53.34,81.91 40.43,69 12.54,69 12.12,68.58 J3.A | 60.96,81.91 v85.09,81.91 85.09,60.32 | C4.2 96.52,38.73 96.52,51.44 93.98,53.98 88.9,53.98 85.09,57.78 85.09,60.32 | OK1.5 85.09,60.32 | IC2.24 IC2.1 | v20.95,66.04 19.05,66.04 15.88,62.86 15.88,53.34 10.79,48.26 8.26,48.26 | J3.9 8.26,48.26 | J3.8 8.26,50.8 8.26,48.26 | C3.2 60.96,81.91 | J3.Z 40.64,15.24 40.64,7.62 57.78,7.62 IC1.1
  Bottom 0.152: 154.94,32.38 X1.2 | IC6.7 109.22,58.42 109.22,76.83 110.49,78.11 IC7.7
  Bottom 0.508: IC4.7 IC2.1 | 154.94,32.38 150.5,27.94 150.5,10.16 IC5.7 143.51,0.64 118.11,0.64 | C3.2 77.47,75.56 81.28,71.75 81.28,57.78 IC3.14 78.74,51.44 71.12,51.44 68.58,48.89 IC2.23 IC2.24 60.96,47.62 C2.2 | X1.2 X1.PE 166.29,30.05 166.29,12.07 | 175.11,50.16 175.11,12.07 166.29,12.07 | 175.11,50.16 175.11,71.75 167.64,71.75 165.1,74.3 | X2.PE 175.11,50.16 | IC8.7 52.07,26.04 53.34,24.77 53.34,0.64 | 53.34,0.64 50.8,0.64 48.26,3.17 48.26,8.26 40.64,8.26 40.64,15.24 J3.Z | IC1.1 58.42,0.64 | 58.42,0.64 53.34,0.64 | 58.42,0.64 118.11,0.64 | C5.2 118.11,0.64 | 111.12,81.91 157.48,81.91 165.1,74.3 | 111.12,81.91 v85.09,81.91 | IC7.7 111.12,81.91 | v20.95,66.04 18.41,68.58 J3.A | J1.SLV 166.29,10.9 166.29,12.07 | J2.SLV 165.1,74.3
N$1
  Bottom 0.152: IC4.5 57.78,30.48 69.22,30.48 IC2.3 IC2.4
N$2
  Top 0.152: R2.1 155.45,28.07 X1.4
N$3
  Bottom 0.152: IC2.6 78.74,33.66 80.01,34.92 99.06,34.92 100.33,36.2 100.33,47.62 101.6,48.89 IC6.11
N$4
  Top 0.152: IC4.2 48.26,33.66 49.53,34.92 57.15,34.92 58.42,33.66 IC4.6
N$5
  Bottom 0.152: IC6.9 IC6.10
N$6
  Top 0.152: IC6.8 104.78,56.52 107.31,53.98 107.31,41.91 109.86,39.37 135.25,39.37 R8.2
N$7
  Bottom 0.152: IC1.13 88.9,12.07 92.08,15.24 104.78,15.24 111.12,21.59 IC6.1
N$8
  Bottom 0.152: IC5.6 IC5.5 138.43,4.44 137.16,5.71 134.62,5.71 133.35,4.44 IC5.3
N$9
  Bottom 0.152: IC5.9 IC5.8 146.05,10.79 147.32,12.07 147.32,38.73 149.86,41.27 163.83,41.27 D2.A
N$10
  Top 0.152: IC5.10 138.43,12.07 137.79,12.7 133.99,12.7 133.35,12.07 IC5.12
  Bottom 0.152: IC5.13 IC5.12
N$11
  Top 0.152: IC1.18 108.27,1.59 117.79,1.59 125.09,8.89 135.25,8.89 135.89,9.53 IC5.11
N$12
  Bottom 0.152: IC1.40 59.69,22.22 59.69,5.08 62.87,1.91 111.76,1.91 116.84,6.99 119.38,6.99 125.09,1.27 127.63,1.27 127.64,1.28 135.25,1.26 135.89,1.91 IC5.4
N$13
  Top 0.152: IC5.1 128.27,4.44 130.18,6.35 146.69,6.35 R7.2
N$14
  Bottom 0.152: R19.1 130.81,55.24 140.97,55.24 LED6.A
N$15
  Bottom 0.152: R18.1 127.64,57.15 127.64,55.88 128.91,54.61 132.08,54.61 132.72,54.61 135.25,54.61 LED5.A
N$16
  Bottom 0.152: R20.1 127,59.05 127,55.24 128.27,53.98 130.81,53.98 132.08,52.7 LED7.A
N$17
  Bottom 0.152: R14.1 125.73,60.32 LED1.A
N$18
  Bottom 0.152: R15.1 119.38,56.52 LED2.A
N$19
  Top 0.152: LED8.A 125.73,69.22 R21.1
N$20
  Top 0.152: LED9.A R22.1
N$21
  Top 0.152: LED8.K 115.57,74.3 115.57,70.47 111.12,66.03 IC7.2
N$22
  Top 0.152: IC7.4 114.3,73.66 114.3,75.56 115.57,76.83 121.92,76.83 LED9.K
N$23
  Top 0.152: IC7.6 113.67,78.11 127,78.11 LED10.K
N$24
  Top 0.152: IC7.8 107.31,78.11 108.58,79.38 132.08,79.38 LED4.K
N$25
  Top 0.152: IC7.10 101.6,75.56 101.6,78.11 102.87,80.01 137.79,80.01 LED3.K
N$26
  Top 0.152: IC7.12 109.86,61.59 111.76,61.59 114.94,58.42 114.94,55.88 116.84,53.98 LED2.K
N$27
  Top 0.152: R23.1 132.08,73.03 LED10.A
N$28
  Top 0.152: LED4.A 138.43,74.3 R17.1
N$29
  Top 0.152: R16.1 138.43,66.67 144.78,73.03 LED3.A
N$30
  Top 0.152: S1.1 140.97,23.49 143.51,26.04 143.51,34.92 148.59,40 148.59,61.59 R11.1
  Bottom 0.152: IC1.5 68.58,6.99 72.39,3.17 108.58,3.17 111.12,5.71 111.12,10.16 118.11,17.14 135.04,17.14 S1.1
N$31
  Top 0.152: S1.3 135.89,23.49 142.24,29.84 142.24,36.2 147.32,41.27 147.32,60.32 R12.1
  Bottom 0.152: IC1.6 71.12,6.99 73.66,4.44 107.31,4.44 110.49,7.62 110.49,11.43 117.47,18.41 132.08,18.41 S1.3
N$32
  Bottom 0.152: IC1.7 73.66,6.99 74.93,5.71 106.68,5.71 109.22,8.26 109.22,12.07 116.84,19.68 128.27,19.68 S1.5 142.24,33.66 142.24,38.73 147.96,44.45 147.96,54.61 R13.1
N$33
  Top 0.152: R4.1 129.06,7.78 148.04,7.78 J1.T
  Bottom 0.152: R7.1 163.83,3.25 J1.T
N$34
  Bottom 0.152: D2.C 170.18,41.27 R6.1 161.29,50.16 161.29,52.7 C1.1
N$35
  Bottom 0.152: R3.1 151.16,78.11 160.58,68.69 160.58,66.67 | 160.58,66.67 J2.T | C1.2 170.18,66.67 160.58,66.67
N$36
  Bottom 0.152: R9.1 123.83,8.26 127,8.26 130.81,4.44 IC5.2
N$37
  Bottom 0.152: R5.1 R9.2 124.95,25.4 125.73,24.39 S1.7
N$38
  Top 0.152: S1.10 125.73,15.88 128.26,18.41 158.67,18.41 J1.R
N$39
  Top 0.152: OK1.2 97.79,60.32 99.69,62.23 D1.A 99.69,78.74 101.6,80.64 142.24,80.64 156.21,66.67 156.21,55.24 156.12,54.91 X2.5
N$40
  Top 0.152: OK1.1 93.98,60.32 93.98,75.56 100.33,81.91 149.22,81.91 171.45,59.69 R1.2
  Bottom 0.152: OK1.1 98.42,57.78 D1.C
N$41
  Bottom 0.152: R10.1 91.44,62.86 | 91.44,62.86 91.44,59.05 99.06,51.44 99.06,36.83 98.42,36.2 70.48,36.2 68.58,34.29 IC2.2 | OK1.4 91.44,62.86
N$42
  Top 0.152: IC6.12 102.23,46.35 101.6,47.62 101.6,57.15 103.5,59.05 111.76,59.05 113.67,57.15 113.67,52.65 117,49.37 121.13,49.37 LED1.K
N$43
  Bottom 0.152: IC7.1 111.12,60.8 114.3,57.63 114.3,21.59 105.41,12.7 95.89,12.7 93.98,10.79 IC1.15
N$44
  Bottom 0.152: IC1.9 78.74,14.61 84.45,20.32 100.97,20.32 102.87,22.22 102.87,34.61 106.28,38.02 106.28,64.14 104.78,65.41 IC7.13
N$45
  Bottom 0.152: IC1.16 96.52,10.16 97.79,11.43 105.41,11.43 114.94,20.96 114.94,64.13 IC7.3
N$46
  Bottom 0.152: IC1.17 99.06,9.53 99.69,10.16 105.41,10.16 115.57,20.32 115.57,68.58 IC7.5
N$47
  Bottom 0.152: IC1.11 83.82,13.34 88.27,17.78 104.14,17.78 108.11,21.75 108.11,71.6 104,75.56 IC7.9
N$48
  Bottom 0.152: IC1.10 81.28,13.97 86.36,19.05 103.5,19.05 105.41,20.95 105.41,34.61 107.08,36.27 107.08,67.94 104.14,70.48 IC7.11
N$49
  Bottom 0.152: IC6.13 101.6,43.81 100.64,42.53 100.64,36.07 100.33,35.76 100.33,22.22 99.69,21.59 82.55,21.59 76.2,15.24 IC1.8
N$50
  Top 0.152: IC6.6 113.88,51.22 118.24,46.12 124.22,46.12 LED7.K
N$51
  Bottom 0.152: IC1.14 91.44,11.43 93.98,13.97 105.41,13.97 113.67,22.22 113.67,48.89 IC6.5
N$52
  Bottom 0.152: IC6.3 109.06,44.29 109.06,21.51 104.1,16.54 90.17,16.51 86.36,12.7 IC1.12
N$53
  Top 0.152: IC6.4 114.94,45.09 129.54,45.09 LED5.K
N$54
  Top 0.152: IC6.2 132.08,43.81 LED6.K
N$55
  Top 0.152: R8.1 150.62,36.7 X1.5
N$56
  Top 0.152: X2.4 157.48,48.89 168.91,48.89 R1.1
N$57
  Bottom 0.152: IC8.8 40.64,28.57 40.64,37.46 51.44,48.26 64.14,48.26 69.85,53.98 69.85,64.14 66.04,67.94 IC3.20
PHI2
  Top 0.152: IC1.25 96.52,22.22 95.25,20.95 58.42,20.95 57.15,22.22 57.15,26.04 IC4.3
  Bottom 0.152: IC4.3 56.52,38.1 88.27,38.1 96.52,46.35 96.52,48.89 95.25,50.16 91.44,50.16 90.17,50.16 84.45,55.88 84.45,73.66 77.47,80.64 51.44,80.64 42.55,71.75 42.55,64.14 36.83,58.42 J3.E
  Bottom 0.508: IC2.14 91.44,50.16
R!W  (via drill 0.35)
  Top 0.152: IC1.21 106.68,22.22 102.87,18.41 58.42,18.41 55.24,21.59 55.24,25.4 52.07,28.57 40.96,28.57 39.37,30.16 39.37,36.83 29.21,46.99 29.21,50.16 34.92,55.88 38.07,55.88 v38.1,55.91 | v13.97,55.88 11.43,58.42 J3.5
  Bottom 0.152: v38.1,55.91 38.07,55.88 v13.97,55.88

### Text on the board
tNames: 27C128 | Model 64 Sequencer